# Altium project FiltrosAAR.PrjPcb
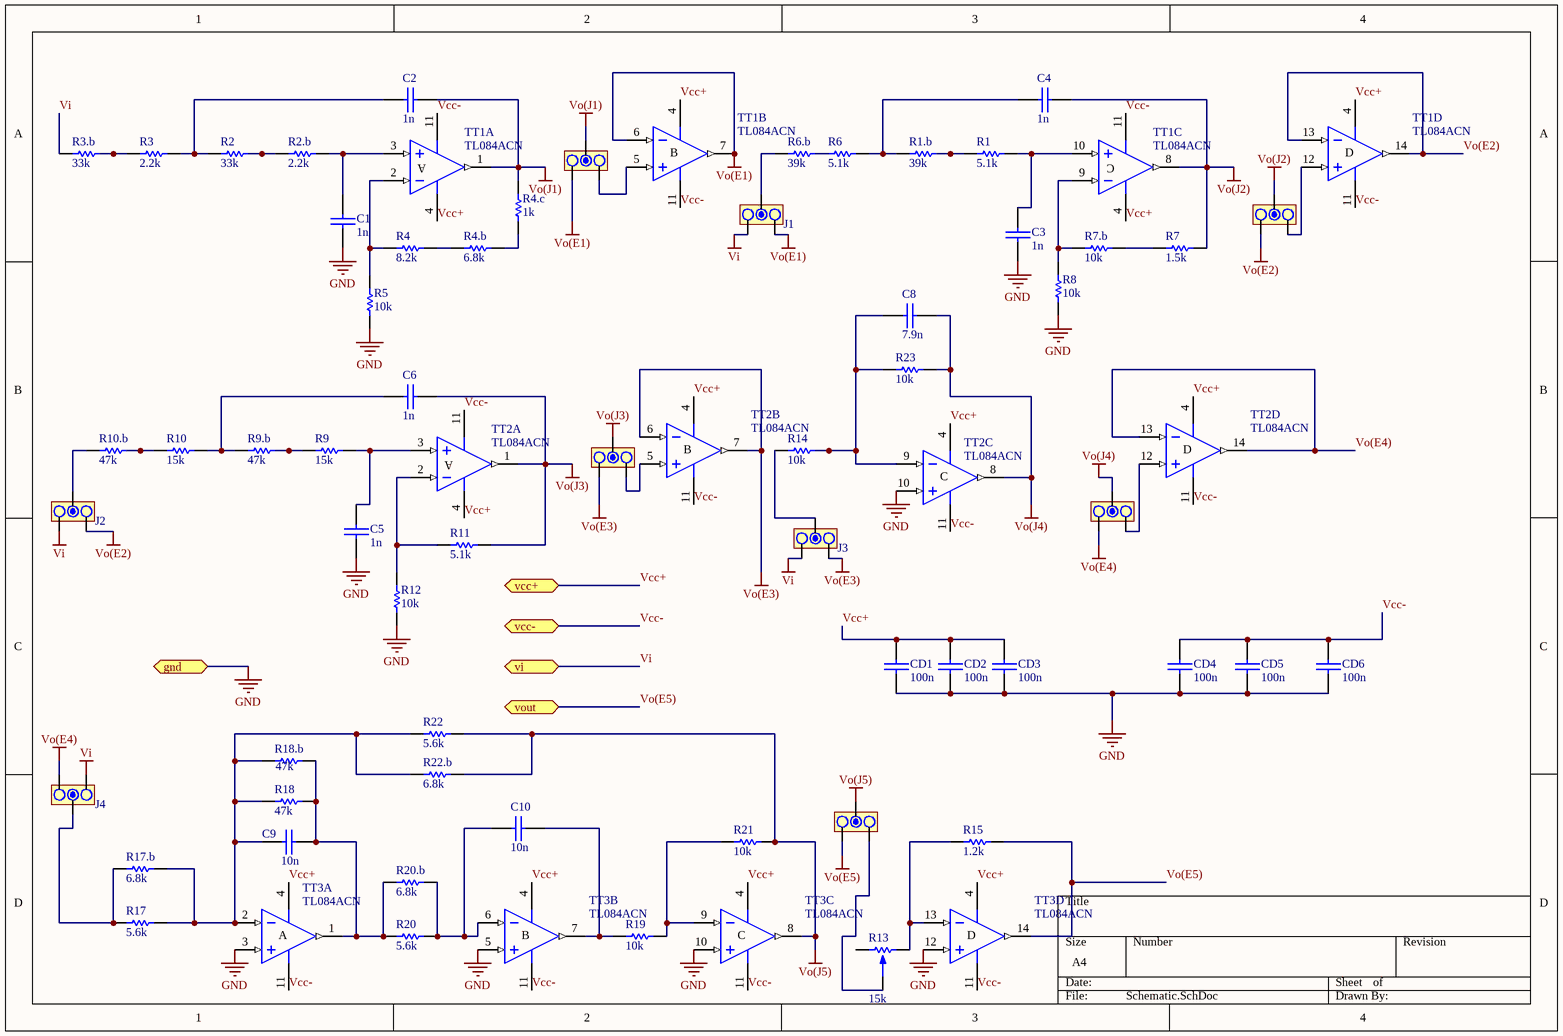
[diagram p0: Schematic.SchDoc]
1 sheet, 62 parts. Net scope: flat (ports and power ports of the same name join across sheets).
Board file: PCB.PcbDoc

## Sheet Schematic.SchDoc
size A4

### Parts
C1  1n  [CAP200]
C2  1n  [CAP200]
C3  1n  [CAP200]
C4  1n  [CAP200]
C5  1n  [CAP200]
C6  1n  [CAP200]
C8  7.9n  [CAP200]
C9  10n  [CAP200]
C10  10n  [CAP200]
CD1  100n  [CAP200]
CD2  100n  [CAP200]
CD3  100n  [CAP200]
CD4  100n  [CAP200]
CD5  100n  [CAP200]
CD6  100n  [CAP200]
J1  JUMPER  [JUMPER3]  (value not drawn)
J2  JUMPER  [JUMPER3]  (value not drawn)
J3  JUMPER  [JUMPER3]  (value not drawn)
J4  JUMPER  [JUMPER3]  (value not drawn)
Jumper1  JUMPER  [JUMPER3]  (value not drawn)
Jumper2  JUMPER  [JUMPER3]  (value not drawn)
Jumper3  JUMPER  [JUMPER3]  (value not drawn)
Jumper4  JUMPER  [JUMPER3]  (value not drawn)
Jumper5  JUMPER  [JUMPER3]  (value not drawn)
R1  5.1k  [RES400]
R1.b  39k  [RES400]
R2  33k  [RES400]
R2.b  2.2k  [RES400]
R3  2.2k  [RES400]
R3.b  33k  [RES400]
R4  8.2k  [RES400]
R4.b  6.8k  [RES400]
R4.c  1k  [RES400]
R5  10k  [RES400]
R6  5.1k  [RES400]
R6.b  39k  [RES400]
R7  1.5k  [RES400]
R7.b  10k  [RES400]
R8  10k  [RES400]
R9  15k  [RES400]
R9.b  47k  [RES400]
R10  15k  [RES400]
R10.b  47k  [RES400]
R11  5.1k  [RES400]
R12  10k  [RES400]
R13  15k  [PRESET V]
R14  10k  [RES400]
R15  1.2k  [RES400]
R17  5.6k  [RES400]
R17.b  6.8k  [RES400]
R18  47k  [RES400]
R18.b  47k  [RES400]
R19  10k  [RES400]
R20  5.6k  [RES400]
R20.b  6.8k  [RES400]
R21  10k  [RES400]
R22  5.6k  [RES400]
R22.b  6.8k  [RES400]
R23  10k  [RES400]
TT1  TL084ACN  [DIP14]  (parts A,B,C,D of 4)
TT2  TL084ACN  [DIP14]  (parts A,B,C,D of 4)
TT3  TL084ACN  [DIP14]  (parts A,B,C,D of 4)

### Ports
gnd, vcc+, vcc-, vi, vout

### Nets
GND: C1.1 C3.1 C5.1 CD1.2 CD2.2 CD3.2 CD4.2 CD5.2 CD6.2 R5.1 R8.1 R12.1 TT2.10(IN+) TT3.3(IN+) TT3.5(IN+) TT3.10(IN+) TT3.12(IN+) ; port gnd
Vi: J1.3 J2.3 J3.3 J4.3 R3.b.1 ; port vi
Vo(E1): J1.1 Jumper1.3 TT1.6(IN-) TT1.7(OUT)
Vo(E2): J2.1 Jumper2.3 TT1.13(IN-) TT1.14(OUT)
Vo(E3): J3.1 Jumper3.3 TT2.6(IN-) TT2.7(OUT)
Vo(E4): J4.1 Jumper4.3 TT2.13(IN-) TT2.14(OUT)
Vo(E5): Jumper5.3 R15.2 TT3.14(OUT) ; port vout
Vo(J1): C2.2 Jumper1.2 R4.c.2 TT1.1(OUT)
Vo(J2): C4.2 Jumper2.2 R7.2 TT1.8(OUT)
Vo(J3): C6.2 Jumper3.2 R11.1 TT2.1(OUT)
Vo(J4): C8.2 Jumper4.2 R23.2 TT2.8(OUT)
Vo(J5): Jumper5.2 R21.2 R22.2 R22.b.2 TT3.8(OUT)
Vcc+: CD1.1 CD2.1 CD3.1 TT1.4(V+) TT2.4(V+) TT3.4(V+) ; port vcc+
Vcc-: CD4.1 CD5.1 CD6.1 TT1.11(V-) TT2.11(V-) TT3.11(V-) ; port vcc-
NetC1_2: C1.2 R2.b.2 TT1.3(IN+)
NetC2_1: C2.1 R2.1 R3.2
NetC3_2: C3.2 R1.2 TT1.10(IN+)
NetC4_1: C4.1 R1.b.1 R6.2
NetC5_2: C5.2 R9.2 TT2.3(IN+)
NetC6_1: C6.1 R9.b.1 R10.2
NetC8_1: C8.1 R14.2 R23.1 TT2.9(IN-)
NetC9_1: C9.1 R17.2 R17.b.2 R18.1 R18.b.1 R22.1 R22.b.1 TT3.2(IN-)
NetC9_2: C9.2 R18.2 R18.b.2 R20.1 R20.b.1 TT3.1(OUT)
NetC10_1: C10.1 R20.2 R20.b.2 TT3.6(IN-)
NetC10_2: C10.2 R19.1 TT3.7(OUT)
NetJ1_2: J1.2 R6.b.1
NetJ2_2: J2.2 R10.b.1
NetJ3_2: J3.2 R14.1
NetJ4_2: J4.2 R17.1 R17.b.1
NetJumper1_1: Jumper1.1 TT1.5(IN+)
NetJumper2_1: Jumper2.1 TT1.12(IN+)
NetJumper3_1: Jumper3.1 TT2.5(IN+)
NetJumper4_1: Jumper4.1 TT2.12(IN+)
NetJumper5_1: Jumper5.1 R13.2
NetR1_1: R1.1 R1.b.2
NetR2_2: R2.2 R2.b.1
NetR3_1: R3.1 R3.b.2
NetR4.b_2: R4.b.2 R4.c.1
NetR4_1: R4.1 R4.b.1
NetR4_2: R4.2 R5.2 TT1.2(IN-)
NetR6_1: R6.1 R6.b.2
NetR7.b_2: R7.b.2 R8.2 TT1.9(IN-)
NetR7_1: R7.1 R7.b.1
NetR9_1: R9.1 R9.b.2
NetR10_1: R10.1 R10.b.2
NetR11_2: R11.2 R12.2 TT2.2(IN-)
NetR13_1: R13.1 R15.1 TT3.13(IN-)
NetR19_2: R19.2 R21.1 TT3.9(IN-)

Not connected (* = marked no-connect by the designer): R13 3

### Notes on the sheet
- (in symbol TL084ACN, part A) A
- (in symbol TL084ACN, part B) B
- (in symbol TL084ACN, part C) C
- (in symbol TL084ACN, part D) D

### Library data of the parts
C1-C6 C8-C10 CD1-CD6 = CAP
J1-J4 Jumper1-Jumper5 = JUMPER3
R1 R1.b R2 R2.b R3 R3.b R4 R4.b R4.c R5 R6 R6.b R7 R7.b R8 R9 R9.b R10 R10.b R11 R12 R14 R15 R17 R17.b R18 R18.b R19 R20 R20.b R21 R22 R22.b R23 = RES
R13 = PRESET
TT1-TT3 = TL084ACN: General-Purpose J-FET Quad Operational Amplifier; Published: 24-Aug-2001; LatestRevisionDate: 06-Jun-2005; LatestRevisionNote: Stylized 3D Model Added.; DatasheetVersion: Jan-1999; PackageVersion: Jan-1997; PackageReference: DIP14; Publisher: Altium Limited; PackageDescription: DIP; 14 Leads; Row Spacing 7.62 mm; Pitch 2.54 mm; ComponentLink1Description: Manufacturer Link; ComponentLink1URL: http://www.st.com/; ComponentLink2Description: Datasheet; ComponentLink2URL: http://www.st.com/stonline/products/literature/ds/2301/tl084.pdf